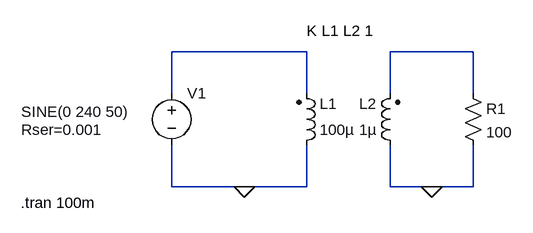
[diagram p0: schematic opamp.asc]
opamp.asc, the LTspice schematic file:
Version 4
SHEET 1 880 680
WIRE 208 80 0 80
WIRE 464 80 336 80
WIRE 0 144 0 80
WIRE 208 144 208 80
WIRE 336 144 336 80
WIRE 464 144 464 80
WIRE 0 288 0 224
WIRE 112 288 0 288
WIRE 208 288 208 224
WIRE 208 288 112 288
WIRE 336 288 336 224
WIRE 400 288 336 288
WIRE 464 288 464 224
WIRE 464 288 400 288
FLAG 112 288 0
FLAG 400 288 0
SYMBOL voltage 0 128 R0
WINDOW 3 -231 44 Left 2
WINDOW 123 0 0 Left 0
WINDOW 39 -231 72 Left 2
SYMATTR InstName V1
SYMATTR Value SINE(0 240 50)
SYMATTR SpiceLine Rser=0.001
SYMBOL ind2 192 240 M180
WINDOW 0 36 80 Left 2
WINDOW 3 36 40 Left 2
SYMATTR InstName L1
SYMATTR Value 100µ
SYMATTR Type ind
SYMBOL ind2 352 240 R180
WINDOW 0 36 80 Left 2
WINDOW 3 36 40 Left 2
SYMATTR InstName L2
SYMATTR Value 1µ
SYMATTR Type ind
SYMBOL res 448 128 R0
SYMATTR InstName R1
SYMATTR Value 100
TEXT 208 48 Left 2 !K L1 L2 1
TEXT -232 312 Left 2 !.tran 100m

The netlist it stands for:
* opamp.asc
V1 N001 0 SINE(0 240 50) Rser=0.001
L1 0 N001 100µ
L2 0 N002 1µ
R1 N002 0 100
K L1 L2 1
.tran 100m
.backanno
.end